# Altium schematic sheet MCU.SchDoc
size A4; SheetNumber: 5; SheetTotal: 6
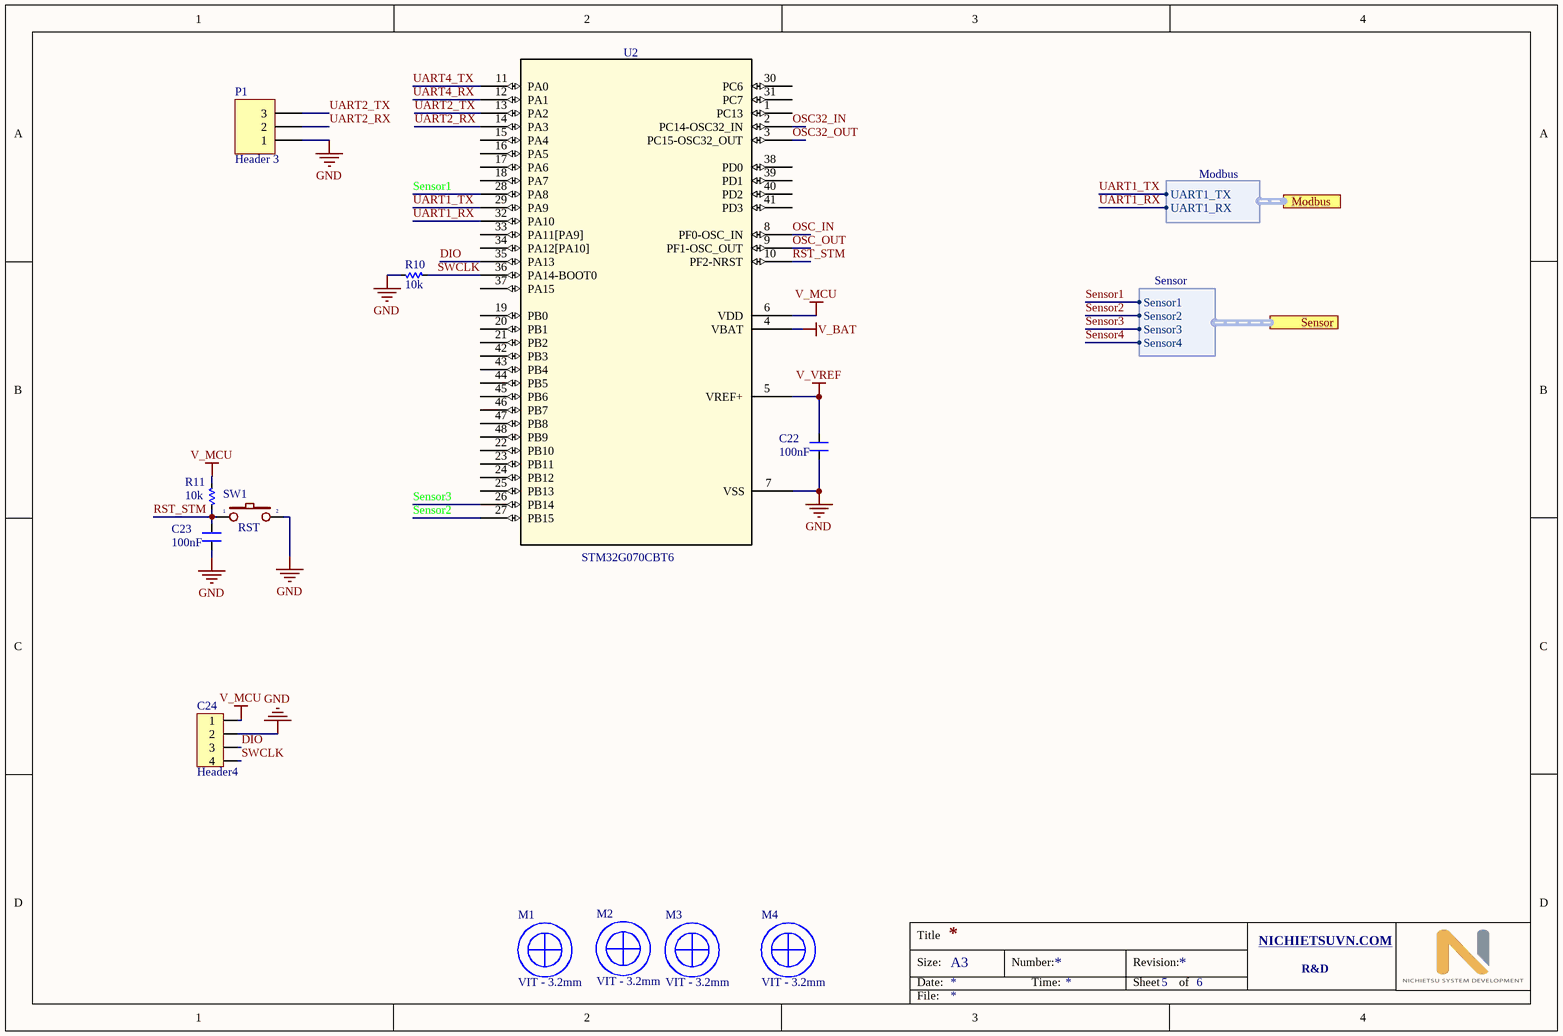
[diagram p0: MCU.SchDoc]

## Parts
C22  100nF  [CN-SMD-0603]
C23  100nF  [CN-SMD-0603]
C24  Header4  [Header4]
M1  VIT - 3.2mm  [VIT - 3.2MM_2]
M2  VIT - 3.2mm  [VIT - 3.2MM_2]
M3  VIT - 3.2mm  [VIT - 3.2MM_2]
M4  VIT - 3.2mm  [VIT - 3.2MM_2]
P1  Header 3  [Header 3]
R10  10k  [RES-SMD-0603]
R11  10k  [RES-SMD-0603]
SW1  RST  [SW1-SMD]
U2  STM32G070CBT6  [STM32G070CBT6]

## Ports
Modbus (harness Modbus), Sensor (harness Sensor)

## Harnesses
Modbus: UART1_TX, UART1_RX
Sensor: Sensor1, Sensor2, Sensor3, Sensor4

## Nets
GND: C22.2 C23.2 C24.2 P1.1 R10.2 SW1.2 U2.7(VSS)
V_BAT: U2.4(VBAT)
V_MCU: C24.1 R11.1 U2.6(VDD)
V_VREF: C22.1 U2.5(VREF+)
DIO: C24.3 U2.35(PA13)
OSC32_IN: U2.2(PC14-OSC32_IN)
OSC32_OUT: U2.3(PC15-OSC32_OUT)
OSC_IN: U2.8(PF0-OSC_IN)
OSC_OUT: U2.9(PF1-OSC_OUT)
RST_STM: C23.1 R11.2 SW1.1 U2.10(PF2-NRST)
Sensor1: U2.28(PA8) ; port Sensor.Sensor1
Sensor2: U2.27(PB15) ; port Sensor.Sensor2
Sensor3: U2.26(PB14) ; port Sensor.Sensor3
Sensor4: port Sensor.Sensor4
SWCLK: C24.4 R10.1 U2.36(PA14-BOOT0)
UART1_RX: U2.32(PA10) ; port Modbus.UART1_RX
UART1_TX: U2.29(PA9) ; port Modbus.UART1_TX
UART2_RX: P1.2 U2.14(PA3)
UART2_TX: P1.3 U2.13(PA2)
UART4_RX: U2.12(PA1)
UART4_TX: U2.11(PA0)

Not connected (* = marked no-connect by the designer): U2 1(PC13) 15(PA4) 16(PA5) 17(PA6) 18(PA7) 19(PB0) 20(PB1) 21(PB2) 22(PB10) 23(PB11) 24(PB12) 25(PB13) 30(PC6) 31(PC7) 33(PA11[PA9]) 34(PA12[PA10]) 37(PA15) 38(PD0) 39(PD1) 40(PD2) 41(PD3) 42(PB3) 43(PB4) 44(PB5) 45(PB6) 46(PB7) 47(PB8) 48(PB9)

## Notes on the sheet
- Title
- Size:
- Date:
- A3
- Number:
- Time:
- Revision:
- Sheet
- of
- NICHIETSUVN.COM <http://NICHIETSUVN.COM>
- R&D
- File:

## Library data of the parts
C22 C23 = CN: Value: 33pF
C24 = Header4: Header IDC, 4 x 1 Pin Vertical 2.54mm Pitch (Non-Boxed, Male); Manufacturer: W¨¹rth Elektronik eiSos GmbH; partNo: 613002143121; ComponentLink1 Description: Manufacturer; ComponentLink2 Description: Datasheet; NoPins: 02; Created Date: 29 March 2013; ComponentLink1URL: http://www.we-online.com; ComponentLink2URL: http://katalog.we-online.de/em/datasheet/6130xx143121.pdf; Created by: Karrer Zheng
M1-M4 = VIT - 3.2mm_1
P1 = Header 3: Header, 3-Pin; LatestRevisionDate: 17-Jul-2002; LatestRevisionNote: Re-released for DXP Platform.; Publisher: Altium Limited
R10 R11 = Res-SMD: Resistor; Manufacturer: Generic Components; Class: Passive; Published: 08/06/2000; Publisher: Altium Hobart Technology Centre
SW1 = SW2: Switch button 2 pin; Value: SW chip 2 pin
U2 = STM32G070CBT6: No Description Available; Vendor: STMicroelectronics; Built_By: EMA_UL_Team; SourceLibrary: Updates_to_database_2020-10-19; Manufacturer_Part_Number: STM32G070CBT6; Copyright: Copyright (C) 2018 Accelerated Designs. All rights reserved; RefDes: RefDes; Type: DEV